# Altium schematic sheet Decawave.SchDoc
size A4
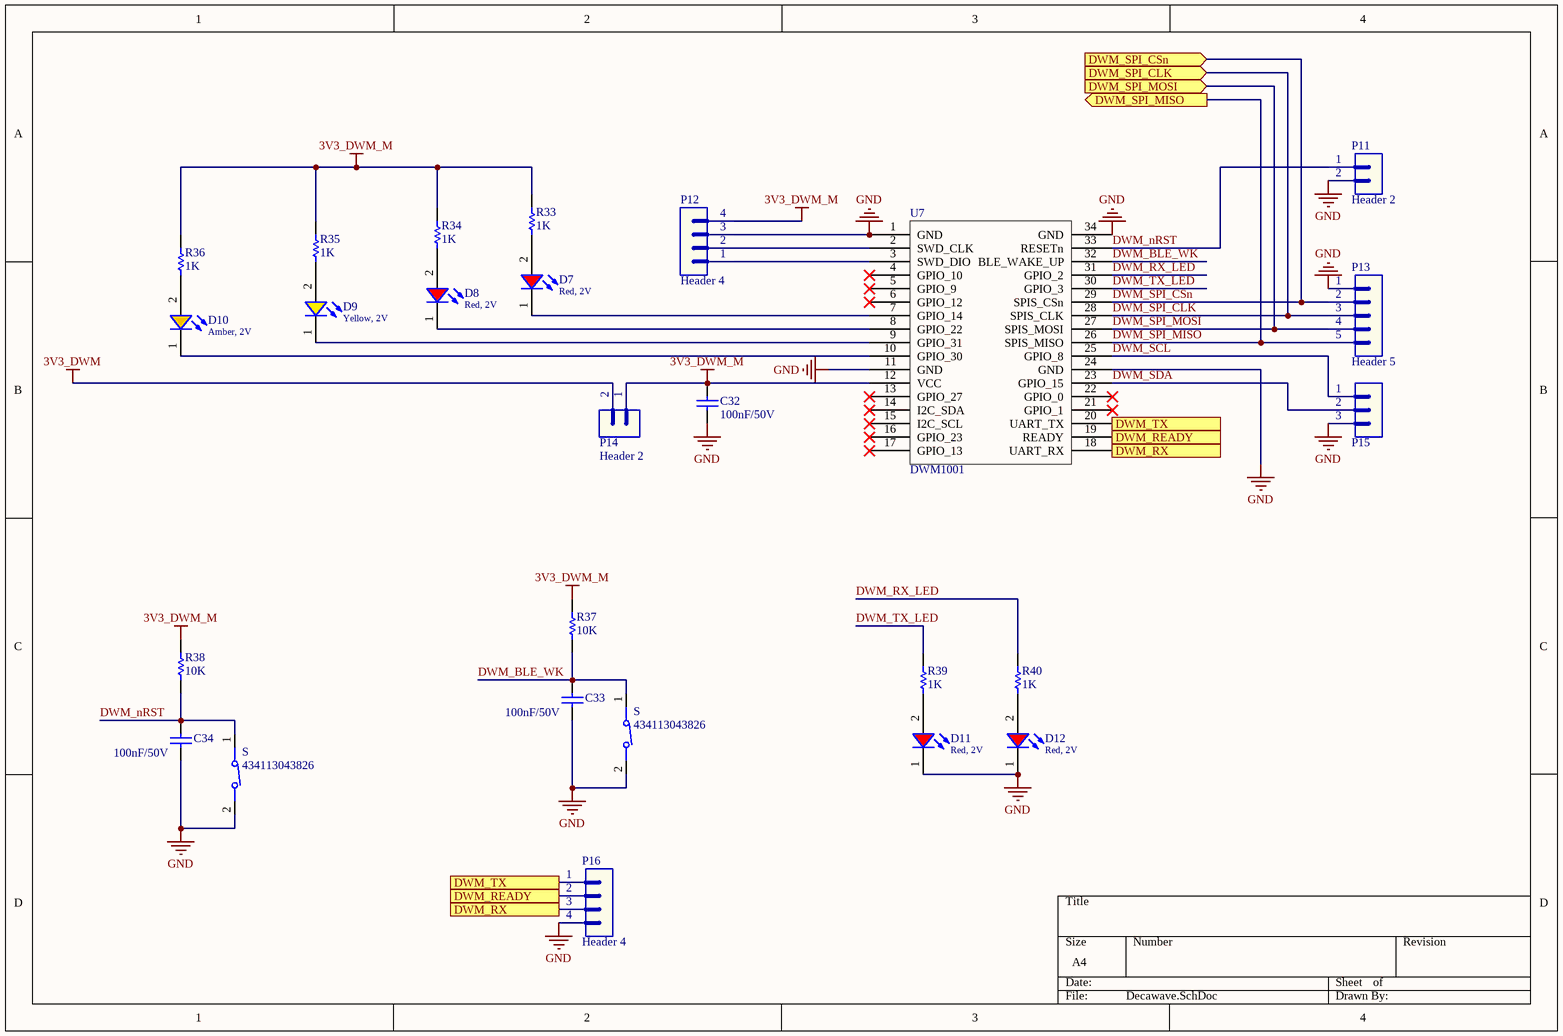
[diagram p0: Decawave.SchDoc]

## Parts
(Parts that share a designator on the sheet are numbered #1, #2 ... from top to bottom, then left to right.)
C32  value 100nF/50V  [CAP-SM-0805]  (hidden comment: Cap-100nF-50V-0805)
C33  value 100nF/50V  [CAP-SM-0805]  (hidden comment: Cap-100nF-50V-0805)
C34  value 100nF/50V  [CAP-SM-0805]  (hidden comment: Cap-100nF-50V-0805)
D7  Red, 2V  [WL-SMCW_0603_H=0.7mm]
D8  Red, 2V  [WL-SMCW_0603_H=0.7mm]
D9  Yellow, 2V  [WL-SMCW_0603_H=0.25mm]
D10  Amber, 2V  [WL-SMCW_0603_H=0.7mm]
D11  Red, 2V  [WL-SMCW_0603_H=0.7mm]
D12  Red, 2V  [WL-SMCW_0603_H=0.7mm]
P11  Header 2  [JP2]
P12  Header 4  [JP4]
P13  Header 5  [JP5]
P14  Header 2  [JP2]
P15  Header 3  [JP3]  (value not drawn)
P16  Header 4  [JP4]
R33  value 1K  [RES-SM-0805]  (hidden comment: Res-1K-0805)
R34  value 1K  [RES-SM-0805]  (hidden comment: Res-1K-0805)
R35  value 1K  [RES-SM-0805]  (hidden comment: Res-1K-0805)
R36  value 1K  [RES-SM-0805]  (hidden comment: Res-1K-0805)
R37  value 10K  [RES-SM-0805]  (hidden comment: Res-10k-0805)
R38  value 10K  [RES-SM-0805]  (hidden comment: Res-10k-0805)
R39  value 1K  [RES-SM-0805]  (hidden comment: Res-1K-0805)
R40  value 1K  [RES-SM-0805]  (hidden comment: Res-1K-0805)
S#1  434113043826  [434113043826]
S#2  434113043826  [434113043826]
U7  DWM1001  [DWM1001]

## Ports
DWM_READY (in), DWM_READY (out), DWM_RX (in), DWM_RX (out), DWM_SPI_CLK (in), DWM_SPI_CSn (in), DWM_SPI_MISO (out), DWM_SPI_MOSI (in), DWM_TX (in), DWM_TX (out)

## Nets
3V3_DWM: P14.2
3V3_DWM_M: C32.2 P12.4 P14.1 R33.2 R34.2 R35.2 R36.2 R37.2 R38.2 U7.12(VCC)
GND: C32.1 C33.1 C34.1 D11.1(K) D12.1(K) P11.2 P12.3 P13.1 P15.3 P16.4 S#1.2 S#2.2 U7.1(GND) U7.11(GND) U7.24(GND) U7.34(GND)
DWM_BLE_WK: C33.2 R37.1 S#1.1 U7.32(BLE_WAKE_UP)
DWM_nRST: C34.2 P11.1 R38.1 S#2.1 U7.33(RESETn)
DWM_READY: P16.2 U7.19(READY) ; port DWM_READY
DWM_RX: P16.3 U7.18(UART_RX) ; port DWM_RX
DWM_RX_LED: R40.2 U7.31(GPIO_2)
DWM_SCL: P15.1 U7.25(GPIO_8)
DWM_SDA: P15.2 U7.23(GPIO_15)
DWM_SPI_CLK: P13.3 U7.28(SPIS_CLK) ; port DWM_SPI_CLK
DWM_SPI_CSn: P13.2 U7.29(SPIS_CSn) ; port DWM_SPI_CSn
DWM_SPI_MISO: P13.5 U7.26(SPIS_MISO) ; port DWM_SPI_MISO
DWM_SPI_MOSI: P13.4 U7.27(SPIS_MOSI) ; port DWM_SPI_MOSI
DWM_TX: P16.1 U7.20(UART_TX) ; port DWM_TX
DWM_TX_LED: R39.2 U7.30(GPIO_3)
NetD7_1: D7.1(K) U7.7(GPIO_14)
NetD7_2: D7.2(A) R33.1
NetD8_1: D8.1(K) U7.8(GPIO_22)
NetD8_2: D8.2(A) R34.1
NetD9_1: D9.1(K) U7.9(GPIO_31)
NetD9_2: D9.2(A) R35.1
NetD10_1: D10.1(K) U7.10(GPIO_30)
NetD10_2: D10.2(A) R36.1
NetD11_2: D11.2(A) R39.1
NetD12_2: D12.2(A) R40.1
NetP12_1: P12.1 U7.3(SWD_DIO)
NetP12_2: P12.2 U7.2(SWD_CLK)

Not connected (* = marked no-connect by the designer): U7 4(GPIO_10)* 5(GPIO_9)* 6(GPIO_12)* 13(GPIO_27)* 14(I2C_SDA)* 15(I2C_SCL)* 16(GPIO_23)* 17(GPIO_13)* 21(GPIO_1)* 22(GPIO_0)*

## Library data of the parts
C32-C34 = Cap-100nF-50V-0805: CAP CER 0.1UF 50V Y5V 0805; Manufacturer: Samsung Electro-Mechanics; Manufacturer Part Number: CL21F104ZBCNNNC; Local Supplier: thegioiic; Local Supplier Link: https://thegioiic.com/products/tu-100nf-0-1uf-50v-0805; Supplier 1: Digikey; Supplier 1 Part Number: 1276-1007-1-ND; Supplier 1 Link: https://www.digikey.com/product-detail/en/samsung-electro-mechanics/CL21F104ZBCNNNC/1276-1007-1-ND/3889093
D7 D8 D11 D12 = 150060RS75000: WL-SMCW SMT Mono-color Chip LED Waterclear, size 0603, Red, 2V, 140deg; Chip Technology: AlInGaP; Dominant Wavelength typ.: 625nm; Luminous Intensity typ.: 250mcd; Peak Wavelength typ.: 630nm; Viewing Angle: 140deg; ComponentLink1Description: Manufacturer; ComponentLink1URL: http://www.we-online.de; ComponentLink2URL: https://www.we-online.com/catalog/datasheet/150060RS75000.pdf; ComponentLink2Description: Datasheet; Forward Voltage typ.: 2V; Emitting Color: Red; Mounting Technology: SMT; Operating Temperature: -40 to +85degC; Published Date: December 2019; Part Number: 150060RS75000; Packaging: Tape and Reel; Size: 0603; Publisher: Wurth Elektronik
D9 = 150060YS75020: WL-SMCW SMT Mono-color Chip LED Waterclear, size 0603, Yellow, 2V, 140deg; Chip Technology: AlInGaP; Dominant Wavelength typ.: 590nm; Luminous Intensity typ.: 130mcd; Peak Wavelength typ.: 595nm; Viewing Angle: 140deg; ComponentLink1Description: Manufacturer; ComponentLink1URL: http://www.we-online.de; ComponentLink2URL: https://www.we-online.com/catalog/datasheet/150060YS75020.pdf; ComponentLink2Description: Datasheet; Forward Voltage typ.: 2V; Emitting Color: Yellow; Mounting Technology: SMT; Operating Temperature: -40 to +85degC; Published Date: March 2020; Part Number: 150060YS75020; Packaging: Tape and Reel; Size: 0603; Publisher: Wurth Elektronik
D10 = 150060AS75000: WL-SMCW SMT Mono-color Chip LED Waterclear, size 0603, Amber, 2V, 140deg; Chip Technology: AlInGaP; Dominant Wavelength typ.: 605nm; Luminous Intensity typ.: 130mcd; Peak Wavelength typ.: 610nm; Viewing Angle: 140deg; ComponentLink1Description: Manufacturer; ComponentLink1URL: http://www.we-online.de; ComponentLink2URL: https://www.we-online.com/catalog/datasheet/150060AS75000.pdf; ComponentLink2Description: Datasheet; Forward Voltage typ.: 2V; Emitting Color: Amber; Mounting Technology: SMT; Operating Temperature: -40 to +85degC; Published Date: December 2019; Part Number: 150060AS75000; Packaging: Tape and Reel; Size: 0603; Publisher: Wurth Elektronik
P11 P14 = Header 2: Header, 2-Pin; LatestRevisionDate: 17-Jul-2002; LatestRevisionNote: Re-released for DXP Platform.; Publisher: Altium Limited
P12 P16 = Header 4: Header, 4-Pin; LatestRevisionDate: 17-Jul-2002; LatestRevisionNote: Re-released for DXP Platform.; Publisher: Altium Limited
P13 = Header 5: Header, 5-Pin; LatestRevisionDate: 17-Jul-2002; LatestRevisionNote: Re-released for DXP Platform.; Publisher: Altium Limited
P15 = Header 3: Header, 3-Pin; LatestRevisionDate: 17-Jul-2002; LatestRevisionNote: Re-released for DXP Platform.; Publisher: Altium Limited
R33-R36 R39 R40 = Res-1K-0805: RES 1K OHM 1% 1/4W 0805; Manufacturer: Stackpole Electronics Inc; Manufacturer Part Number: RNCP0805FTD1K00; Local Supplier: thegioiic; Local Supplier Link: https://thegioiic.com/products/dien-tro-1k-ohm-0805-5; Supplier 1: Digikey; Supplier 1 Link: https://www.digikey.com/product-detail/en/stackpole-electronics-inc/RNCP0805FTD1K00/RNCP0805FTD1K00CT-ND/2240568; Supplier 1 Part Number: RNCP0805FTD1K00CT-ND
R37 R38 = Res-10k-0805: RES 10K OHM 1% 1/4W 0805; Manufacturer: Stackpole Electronics Inc; Manufacturer Part Number: RNCP0805FTD10K0; Local Supplier: thegioiic; Local Supplier Link: https://thegioiic.com/products/dien-tro-10k-ohm-0805-5; Supplier 1: Digikey; Supplier 1 Link: https://www.digikey.com/product-detail/en/stackpole-electronics-inc/RNCP0805FTD10K0/RNCP0805FTD10K0CT-ND/2240601; Supplier 1 Part Number: RNCP0805FTD10K0CT-ND
S#1 S#2 = 434113043826: SWITCH TACTILE SPST-NO 0.05A 12V; MF: WÃ¼rth Elektronik; Package: None; Value: *; MP: 434113043826; Availability: Unavailable; SnapEDA_Link: https://www.snapeda.com/parts/434113043826/W%C3%BCrth%20Elektronik/view-part/4797567/?ref=snap; Price: None
U7 = DWM1001: Local Supplier: *; Local Supplier Link: *; Local Supplier Part Number: *; Manufacturer: *; Manufacturer Part Number: *